# Altium project Metlino.PrjPcb (part 13 of 13)

## Sheet FMC_Metlino_Fabric-Timing.SchDoc
size A4
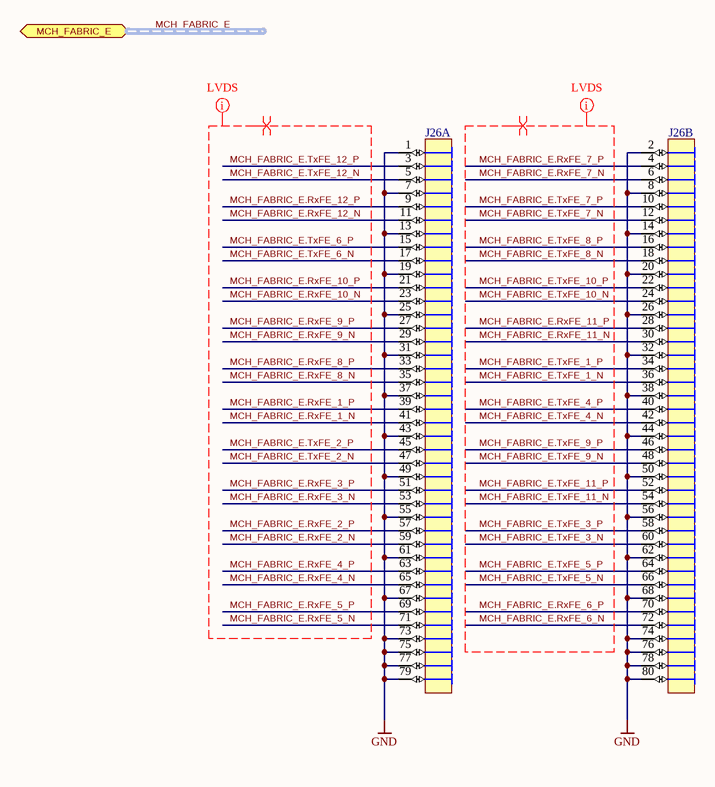
[diagram p29: FMC_Metlino_Fabric-Timing.SchDoc]

### Parts
J26  (no value)  [SAMTEC_FSI-140-XX-X-D-AD_bot]  (parts A,B of 2)  (no BOM)

### Ports
MCH_FABRIC_E (bidir, harness MCH_FABRIC_E)

### Nets
GND: J26.1 J26.2 J26.7 J26.8 J26.13 J26.14 J26.19 J26.20 J26.25 J26.26 J26.31 J26.32 J26.37 J26.38 J26.43 J26.44 J26.49 J26.50 J26.55 J26.56 J26.61 J26.62 J26.67 J26.68 J26.73 J26.74 J26.75 J26.76 J26.77 J26.78 J26.79 J26.80
MCH_FABRIC_E.RxFE_1_N: J26.41
MCH_FABRIC_E.RxFE_1_P: J26.39
MCH_FABRIC_E.RxFE_2_N: J26.59
MCH_FABRIC_E.RxFE_2_P: J26.57
MCH_FABRIC_E.RxFE_3_N: J26.53
MCH_FABRIC_E.RxFE_3_P: J26.51
MCH_FABRIC_E.RxFE_4_N: J26.65
MCH_FABRIC_E.RxFE_4_P: J26.63
MCH_FABRIC_E.RxFE_5_N: J26.71
MCH_FABRIC_E.RxFE_5_P: J26.69
MCH_FABRIC_E.RxFE_6_N: J26.72
MCH_FABRIC_E.RxFE_6_P: J26.70
MCH_FABRIC_E.RxFE_7_N: J26.6
MCH_FABRIC_E.RxFE_7_P: J26.4
MCH_FABRIC_E.RxFE_8_N: J26.35
MCH_FABRIC_E.RxFE_8_P: J26.33
MCH_FABRIC_E.RxFE_9_N: J26.29
MCH_FABRIC_E.RxFE_9_P: J26.27
MCH_FABRIC_E.RxFE_10_N: J26.23
MCH_FABRIC_E.RxFE_10_P: J26.21
MCH_FABRIC_E.RxFE_11_N: J26.30
MCH_FABRIC_E.RxFE_11_P: J26.28
MCH_FABRIC_E.RxFE_12_N: J26.11
MCH_FABRIC_E.RxFE_12_P: J26.9
MCH_FABRIC_E.TxFE_1_N: J26.36
MCH_FABRIC_E.TxFE_1_P: J26.34
MCH_FABRIC_E.TxFE_2_N: J26.47
MCH_FABRIC_E.TxFE_2_P: J26.45
MCH_FABRIC_E.TxFE_3_N: J26.60
MCH_FABRIC_E.TxFE_3_P: J26.58
MCH_FABRIC_E.TxFE_4_N: J26.42
MCH_FABRIC_E.TxFE_4_P: J26.40
MCH_FABRIC_E.TxFE_5_N: J26.66
MCH_FABRIC_E.TxFE_5_P: J26.64
MCH_FABRIC_E.TxFE_6_N: J26.17
MCH_FABRIC_E.TxFE_6_P: J26.15
MCH_FABRIC_E.TxFE_7_N: J26.12
MCH_FABRIC_E.TxFE_7_P: J26.10
MCH_FABRIC_E.TxFE_8_N: J26.18
MCH_FABRIC_E.TxFE_8_P: J26.16
MCH_FABRIC_E.TxFE_9_N: J26.48
MCH_FABRIC_E.TxFE_9_P: J26.46
MCH_FABRIC_E.TxFE_10_N: J26.24
MCH_FABRIC_E.TxFE_10_P: J26.22
MCH_FABRIC_E.TxFE_11_N: J26.54
MCH_FABRIC_E.TxFE_11_P: J26.52
MCH_FABRIC_E.TxFE_12_N: J26.5
MCH_FABRIC_E.TxFE_12_P: J26.3

### Buses and harness runs
harness MCH_FABRIC_E = port MCH_FABRIC_E

### Layout directives
differential pair: MCH_FABRIC_E.RxFE_1_N, MCH_FABRIC_E.RxFE_1_P, MCH_FABRIC_E.RxFE_2_N, MCH_FABRIC_E.RxFE_2_P, MCH_FABRIC_E.RxFE_3_N, MCH_FABRIC_E.RxFE_3_P, MCH_FABRIC_E.RxFE_4_N, MCH_FABRIC_E.RxFE_4_P, MCH_FABRIC_E.RxFE_5_N, MCH_FABRIC_E.RxFE_5_P, MCH_FABRIC_E.RxFE_6_N, MCH_FABRIC_E.RxFE_6_P, MCH_FABRIC_E.RxFE_7_N, MCH_FABRIC_E.RxFE_7_P, MCH_FABRIC_E.RxFE_8_N, MCH_FABRIC_E.RxFE_8_P, MCH_FABRIC_E.RxFE_9_N, MCH_FABRIC_E.RxFE_9_P, MCH_FABRIC_E.RxFE_10_N, MCH_FABRIC_E.RxFE_10_P, MCH_FABRIC_E.RxFE_11_N, MCH_FABRIC_E.RxFE_11_P, MCH_FABRIC_E.RxFE_12_N, MCH_FABRIC_E.RxFE_12_P, MCH_FABRIC_E.TxFE_1_N, MCH_FABRIC_E.TxFE_1_P, MCH_FABRIC_E.TxFE_2_N, MCH_FABRIC_E.TxFE_2_P, MCH_FABRIC_E.TxFE_3_N, MCH_FABRIC_E.TxFE_3_P, MCH_FABRIC_E.TxFE_4_N, MCH_FABRIC_E.TxFE_4_P, MCH_FABRIC_E.TxFE_5_N, MCH_FABRIC_E.TxFE_5_P, MCH_FABRIC_E.TxFE_6_N, MCH_FABRIC_E.TxFE_6_P, MCH_FABRIC_E.TxFE_7_N, MCH_FABRIC_E.TxFE_7_P, MCH_FABRIC_E.TxFE_8_N, MCH_FABRIC_E.TxFE_8_P, MCH_FABRIC_E.TxFE_9_N, MCH_FABRIC_E.TxFE_9_P, MCH_FABRIC_E.TxFE_10_N, MCH_FABRIC_E.TxFE_10_P, MCH_FABRIC_E.TxFE_11_N, MCH_FABRIC_E.TxFE_11_P, MCH_FABRIC_E.TxFE_12_N, MCH_FABRIC_E.TxFE_12_P
net class LVDS: MCH_FABRIC_E.RxFE_1_N, MCH_FABRIC_E.RxFE_1_P, MCH_FABRIC_E.RxFE_2_N, MCH_FABRIC_E.RxFE_2_P, MCH_FABRIC_E.RxFE_3_N, MCH_FABRIC_E.RxFE_3_P, MCH_FABRIC_E.RxFE_4_N, MCH_FABRIC_E.RxFE_4_P, MCH_FABRIC_E.RxFE_5_N, MCH_FABRIC_E.RxFE_5_P, MCH_FABRIC_E.RxFE_6_N, MCH_FABRIC_E.RxFE_6_P, MCH_FABRIC_E.RxFE_7_N, MCH_FABRIC_E.RxFE_7_P, MCH_FABRIC_E.RxFE_8_N, MCH_FABRIC_E.RxFE_8_P, MCH_FABRIC_E.RxFE_9_N, MCH_FABRIC_E.RxFE_9_P, MCH_FABRIC_E.RxFE_10_N, MCH_FABRIC_E.RxFE_10_P, MCH_FABRIC_E.RxFE_11_N, MCH_FABRIC_E.RxFE_11_P, MCH_FABRIC_E.RxFE_12_N, MCH_FABRIC_E.RxFE_12_P, MCH_FABRIC_E.TxFE_1_N, MCH_FABRIC_E.TxFE_1_P, MCH_FABRIC_E.TxFE_2_N, MCH_FABRIC_E.TxFE_2_P, MCH_FABRIC_E.TxFE_3_N, MCH_FABRIC_E.TxFE_3_P, MCH_FABRIC_E.TxFE_4_N, MCH_FABRIC_E.TxFE_4_P, MCH_FABRIC_E.TxFE_5_N, MCH_FABRIC_E.TxFE_5_P, MCH_FABRIC_E.TxFE_6_N, MCH_FABRIC_E.TxFE_6_P, MCH_FABRIC_E.TxFE_7_N, MCH_FABRIC_E.TxFE_7_P, MCH_FABRIC_E.TxFE_8_N, MCH_FABRIC_E.TxFE_8_P, MCH_FABRIC_E.TxFE_9_N, MCH_FABRIC_E.TxFE_9_P, MCH_FABRIC_E.TxFE_10_N, MCH_FABRIC_E.TxFE_10_P, MCH_FABRIC_E.TxFE_11_N, MCH_FABRIC_E.TxFE_11_P, MCH_FABRIC_E.TxFE_12_N, MCH_FABRIC_E.TxFE_12_P

### Library data of the parts
J26 = SAMTEC_FSI-140-10-L-D-AD_bot: Copper Contact Surfaces for Receive 80 Spring Contacts Board to Board & Mezzanine Connectors One-Piece With Alignment Pins; PressFit: No; Part Number: SAMTEC_FSI-140-10-L-D-AD_bot; Component Type: Standard (No BOM); Pin Count: 0; Mounted: Yes; Socket: No; SMD: No; Sense: No; Status: None; Part Description: Copper Contact Surfaces for Receive 80 Spring Contacts Board to Board & Mezzanine Connectors One-Piece With Alignment Pins; ComponentHeight: 0mm; HelpURL: \\cern.ch\dfs\Applications\Altium\Datasheets\SAMTEC_FSI-140-10-L-D-AD.pdf; Author: CERN DEM BC; CreateDate: 08.06.2021; LatestRevisionDate: 08.06.2021

## Nets that join several sheets
GND: Metlino_MCH (25 pins), USB_SERIAL_QUAD (50 pins), SFP1 (37 pins), SFP0 (37 pins), SI5324_CDR_DCXO_oscillators (67 pins), DDMTD (9 pins), FMC_connector (175 pins), SDRAM_DDR3_4x16 (177 pins), JTAG_Configuration (13 pins), POWER_Management (29 pins), PWR_0V9_20A (23 pins), PWR_DC_DC_EXAR (48 pins), Metlino_QUAD_BUCK (40 pins), MCH_CON (116 pins), Metlino_CLK_Distribution (21 pins), Thermometers (24 pins), VHDCI_CON (45 pins), ETH_PHY_RGMII (36 pins), I2C_MUX (7 pins), SFP2 (37 pins), CPU_LPC1776 (12 pins), CPU_LPC1776_SUP_PROG (40 pins), MCH_FPGA_Banks_44_45_46_DDR64 (7 pins), MCH_FPGA_Banks_64_65_HR (C212.1 J25.12 OSC1.2), MCH_FPGA_Banks_224_225_226_227_228 (8 pins), MCH_FPGA_Bank_47_48_67_HP_VHDCI (R253.1), MCH_FPGA_Bank_0_CFG (28 pins), MCH_FPGA_Banks_66_68_HP_FMC (9 pins), MCH_FPGA_Power (18 pins), MCH_FPGA_GND_NC (271 pins), MCH_FPGA_Decoupling (134 pins), FMC_Metlino_Fabric-Timing (32 pins)
MGTAVCC: PWR_DC_DC_EXAR (L15.2 L30.2), MCH_FPGA_Power (14 pins), MCH_FPGA_Decoupling (27 pins)
MGTAVTT: PWR_DC_DC_EXAR (L3.2 R246.1), MCH_FPGA_Bank_0_CFG (IC33.AP6 R405.2), MCH_FPGA_Power (16 pins), MCH_FPGA_Decoupling (22 pins)
MGTVCCAUX: PWR_DC_DC_EXAR (L25.1), MCH_FPGA_Power (IC33.AA6 IC33.R6), MCH_FPGA_Decoupling (5 pins)
P1V5: SDRAM_DDR3_4x16 (131 pins), PWR_DC_DC_EXAR (5 pins), MCH_FPGA_Banks_44_45_46_DDR64 (R193.1 R194.1 R195.1 R196.1), MCH_FPGA_Power (20 pins), MCH_FPGA_Decoupling (9 pins)
P1V8: FMC_connector (7 pins), PWR_DC_DC_EXAR (7 pins), VHDCI_CON (38 pins), MCH_FPGA_Bank_0_CFG (R575.1), MCH_FPGA_Banks_66_68_HP_FMC (R219.1), MCH_FPGA_Power (34 pins), MCH_FPGA_Decoupling (20 pins)
P3V3: USB_SERIAL_QUAD (6 pins), SFP1 (16 pins), SFP0 (16 pins), SI5324_CDR_DCXO_oscillators (R260.1), FMC_connector (6 pins), SDRAM_DDR3_4x16 (C345.1 IC12.7 IC12.10), JTAG_Configuration (6 pins), POWER_Management (R395.1), PWR_DC_DC_EXAR (L12.2 L18.2 R240.2 TP20.1), VHDCI_CON (D53.5 F2.2 F3.2), ETH_PHY_RGMII (9 pins), I2C_MUX (17 pins), SFP2 (16 pins), MCH_FPGA_Banks_64_65_HR (C212.2 J25.11 OSC1.1 OSC1.4), MCH_FPGA_Banks_224_225_226_227_228 (L19.1), MCH_FPGA_Bank_0_CFG (22 pins), MCH_FPGA_Power (15 pins), MCH_FPGA_Decoupling (7 pins)
P3V3_CLK: SI5324_CDR_DCXO_oscillators (7 pins), DDMTD (L29.1), Metlino_CLK_Distribution (L17.1)
P3V3MP: Metlino_MCH (J4.14), USB_SERIAL_QUAD (IC29.1 R398.1 R399.2), POWER_Management (9 pins), PWR_0V9_20A (R387.2), PWR_DC_DC_EXAR (6 pins), Metlino_QUAD_BUCK (R421.2), Thermometers (21 pins), I2C_MUX (9 pins), CPU_LPC1776 (22 pins), CPU_LPC1776_SUP_PROG (39 pins), MCH_FPGA_Bank_0_CFG (C176.2 IC27.14)
P5V0: SI5324_CDR_DCXO_oscillators (L4.1), PWR_DC_DC_EXAR (8 pins), Metlino_QUAD_BUCK (R420.2)
P12V0: POWER_Management (16 pins), PWR_0V9_20A (14 pins), PWR_DC_DC_EXAR (9 pins), Metlino_QUAD_BUCK (10 pins)
PAYLOAD_PWR: Metlino_MCH (J4.9 J4.10 J4.11 J4.12), POWER_Management (C181.2 T5.1 T5.2 T5.3)
Vbias_0.9V: MCH_FPGA_Bank_47_48_67_HP_VHDCI (R47.1 R48.1 R49.1 R86.1), MCH_FPGA_Banks_66_68_HP_FMC (16 pins)
VCCAUX: PWR_DC_DC_EXAR (L24.2 L36.2), MCH_FPGA_Power (15 pins), MCH_FPGA_Decoupling (8 pins)
VCCBRAM: PWR_DC_DC_EXAR (L8.2 R141.2), MCH_FPGA_Power (IC33.AA18 IC33.AB17 IC33.V17 IC33.Y17), MCH_FPGA_Decoupling (10 pins)
VCCINT: PWR_0V9_20A (R393.1 R415.2 R416.2), PWR_DC_DC_EXAR (R141.1 R243.1 TP22.1), MCH_FPGA_Power (49 pins), MCH_FPGA_Decoupling (26 pins)
VTT64: SDRAM_DDR3_4x16 (43 pins), MCH_FPGA_Banks_44_45_46_DDR64 (R11.1 R210.1)
AUX_CLOCK_C2_N: SI5324_CDR_DCXO_oscillators (C108.2 R93.1), Metlino_CLK_Distribution (IC42.21 R347.1)
AUX_CLOCK_C2_P: SI5324_CDR_DCXO_oscillators (C107.2 R93.2), Metlino_CLK_Distribution (IC42.22 R348.1)
AUX_UART_RxD: USB_SERIAL_QUAD (R122.1), MCH_FPGA_Banks_64_65_HR (IC33.AF13)
AUX_UART_TxD: USB_SERIAL_QUAD (R123.1), MCH_FPGA_Banks_64_65_HR (IC33.AE13)
BOOT_MODE0: CPU_LPC1776 (IC40.P9), MCH_FPGA_Bank_0_CFG (R183.2)
BOOT_MODE1: CPU_LPC1776 (IC40.P11), MCH_FPGA_Bank_0_CFG (R182.2)
BOOT_MODE2: CPU_LPC1776 (IC40.P3), MCH_FPGA_Bank_0_CFG (R181.2)
BOOT_MODE3: CPU_LPC1776 (IC40.N5), MCH_FPGA_Bank_0_CFG (R186.2)
CDR_CLK_CLEAN0_N: SI5324_CDR_DCXO_oscillators (C550.2), MCH_FPGA_Banks_66_68_HP_FMC (IC33.G16 R255.2)
CDR_CLK_CLEAN0_P: SI5324_CDR_DCXO_oscillators (C549.2), MCH_FPGA_Banks_66_68_HP_FMC (IC33.G17 R254.2)
CDR_CLK_CLEAN1_N: SI5324_CDR_DCXO_oscillators (C554.2), MCH_FPGA_Banks_224_225_226_227_228 (IC33.V5)
CDR_CLK_CLEAN1_P: SI5324_CDR_DCXO_oscillators (C553.2), MCH_FPGA_Banks_224_225_226_227_228 (IC33.V6)
CDR_CLK_CLEAN2_N: SI5324_CDR_DCXO_oscillators (C544.2), MCH_FPGA_Banks_224_225_226_227_228 (IC33.AB5)
CDR_CLK_CLEAN2_P: SI5324_CDR_DCXO_oscillators (C543.2), MCH_FPGA_Banks_224_225_226_227_228 (IC33.AB6)
CLK0_M2C_N: FMC_connector (J7.h5), MCH_FPGA_Banks_66_68_HP_FMC (IC33.F9)
CLK0_M2C_P: FMC_connector (J7.h4), MCH_FPGA_Banks_66_68_HP_FMC (IC33.G9)
CLK1_M2C_N: FMC_connector (J7.g3), MCH_FPGA_Banks_66_68_HP_FMC (IC33.G12)
CLK1_M2C_P: FMC_connector (J7.g2), MCH_FPGA_Banks_66_68_HP_FMC (IC33.H12)
CLK2_BIDIR_N: SI5324_CDR_DCXO_oscillators (C559.2), FMC_connector (J7.k5)
CLK2_BIDIR_P: SI5324_CDR_DCXO_oscillators (C558.2), FMC_connector (J7.k4)
CLK3_BIDIR_N: FMC_connector (J7.j3), Metlino_CLK_Distribution (C321.2)
CLK3_BIDIR_P: FMC_connector (J7.j2), Metlino_CLK_Distribution (C322.2)
CLK_DIR: FMC_connector (J7.b1), CPU_LPC1776 (R325.1 R326.1)
CLK_MUX_SEL: Metlino_CLK_Distribution (IC42.32), MCH_FPGA_Banks_64_65_HR (IC33.AK11)
DDMTD_OUT_CDR_CLK_N: DDMTD (R438.1 R439.2), MCH_FPGA_Banks_66_68_HP_FMC (C226.2)
DDMTD_OUT_CDR_CLK_P: DDMTD (R435.2 R436.2), MCH_FPGA_Banks_66_68_HP_FMC (C225.2)
DDMTD_OUT_MAIN_CLK_N: DDMTD (R449.1 R451.2), MCH_FPGA_Banks_66_68_HP_FMC (C224.2)
DDMTD_OUT_MAIN_CLK_P: DDMTD (R443.2 R445.2), MCH_FPGA_Banks_66_68_HP_FMC (C223.2)
DDR3_64_A0: SDRAM_DDR3_4x16 (5 pins), MCH_FPGA_Banks_44_45_46_DDR64 (IC33.AE17)
DDR3_64_A1: SDRAM_DDR3_4x16 (5 pins), MCH_FPGA_Banks_44_45_46_DDR64 (IC33.AL17)
DDR3_64_A2: SDRAM_DDR3_4x16 (5 pins), MCH_FPGA_Banks_44_45_46_DDR64 (IC33.AG16)
DDR3_64_A3: SDRAM_DDR3_4x16 (5 pins), MCH_FPGA_Banks_44_45_46_DDR64 (IC33.AG17)
DDR3_64_A4: SDRAM_DDR3_4x16 (5 pins), MCH_FPGA_Banks_44_45_46_DDR64 (IC33.AD16)
DDR3_64_A5: SDRAM_DDR3_4x16 (5 pins), MCH_FPGA_Banks_44_45_46_DDR64 (IC33.AH14)
DDR3_64_A6: SDRAM_DDR3_4x16 (5 pins), MCH_FPGA_Banks_44_45_46_DDR64 (IC33.AD15)
DDR3_64_A7: SDRAM_DDR3_4x16 (5 pins), MCH_FPGA_Banks_44_45_46_DDR64 (IC33.AK15)
DDR3_64_A8: SDRAM_DDR3_4x16 (5 pins), MCH_FPGA_Banks_44_45_46_DDR64 (IC33.AF14)
DDR3_64_A9: SDRAM_DDR3_4x16 (5 pins), MCH_FPGA_Banks_44_45_46_DDR64 (IC33.AF15)
DDR3_64_A10: SDRAM_DDR3_4x16 (5 pins), MCH_FPGA_Banks_44_45_46_DDR64 (IC33.AL18)
DDR3_64_A11: SDRAM_DDR3_4x16 (5 pins), MCH_FPGA_Banks_44_45_46_DDR64 (IC33.AL15)
DDR3_64_A12: SDRAM_DDR3_4x16 (5 pins), MCH_FPGA_Banks_44_45_46_DDR64 (IC33.AE18)
DDR3_64_A13: SDRAM_DDR3_4x16 (5 pins), MCH_FPGA_Banks_44_45_46_DDR64 (IC33.AJ15)
DDR3_64_A14: SDRAM_DDR3_4x16 (5 pins), MCH_FPGA_Banks_44_45_46_DDR64 (IC33.AG14)
DDR3_64_BA0: SDRAM_DDR3_4x16 (5 pins), MCH_FPGA_Banks_44_45_46_DDR64 (IC33.AF17)
DDR3_64_BA1: SDRAM_DDR3_4x16 (5 pins), MCH_FPGA_Banks_44_45_46_DDR64 (IC33.AD19)
DDR3_64_BA2: SDRAM_DDR3_4x16 (5 pins), MCH_FPGA_Banks_44_45_46_DDR64 (IC33.AD18)
DDR3_64_CAS_N: SDRAM_DDR3_4x16 (5 pins), MCH_FPGA_Banks_44_45_46_DDR64 (IC33.AK18)
DDR3_64_CK_N: SDRAM_DDR3_4x16 (5 pins), MCH_FPGA_Banks_44_45_46_DDR64 (IC33.AE15)
DDR3_64_CK_P: SDRAM_DDR3_4x16 (5 pins), MCH_FPGA_Banks_44_45_46_DDR64 (IC33.AE16)
DDR3_64_CKE: SDRAM_DDR3_4x16 (5 pins), MCH_FPGA_Banks_44_45_46_DDR64 (IC33.AL19)
DDR3_64_CS_N: SDRAM_DDR3_4x16 (5 pins), MCH_FPGA_Banks_44_45_46_DDR64 (IC33.AF18)
DDR3_64_DM0: SDRAM_DDR3_4x16 (IC8.E7), MCH_FPGA_Banks_44_45_46_DDR64 (IC33.AD21)
DDR3_64_DM1: SDRAM_DDR3_4x16 (IC8.D3), MCH_FPGA_Banks_44_45_46_DDR64 (IC33.AE25)
DDR3_64_DM2: SDRAM_DDR3_4x16 (IC9.E7), MCH_FPGA_Banks_44_45_46_DDR64 (IC33.AJ21)
DDR3_64_DM3: SDRAM_DDR3_4x16 (IC9.D3), MCH_FPGA_Banks_44_45_46_DDR64 (IC33.AM21)
DDR3_64_DM4: SDRAM_DDR3_4x16 (IC10.E7), MCH_FPGA_Banks_44_45_46_DDR64 (IC33.AH26)
DDR3_64_DM5: SDRAM_DDR3_4x16 (IC10.D3), MCH_FPGA_Banks_44_45_46_DDR64 (IC33.AN26)
DDR3_64_DM6: SDRAM_DDR3_4x16 (IC11.E7), MCH_FPGA_Banks_44_45_46_DDR64 (IC33.AJ29)
DDR3_64_DM7: SDRAM_DDR3_4x16 (IC11.D3), MCH_FPGA_Banks_44_45_46_DDR64 (IC33.AL32)
DDR3_64_DQ0: SDRAM_DDR3_4x16 (IC8.E3), MCH_FPGA_Banks_44_45_46_DDR64 (IC33.AE23)
DDR3_64_DQ1: SDRAM_DDR3_4x16 (IC8.F7), MCH_FPGA_Banks_44_45_46_DDR64 (IC33.AG20)
DDR3_64_DQ2: SDRAM_DDR3_4x16 (IC8.F2), MCH_FPGA_Banks_44_45_46_DDR64 (IC33.AF22)
DDR3_64_DQ3: SDRAM_DDR3_4x16 (IC8.F8), MCH_FPGA_Banks_44_45_46_DDR64 (IC33.AF20)
DDR3_64_DQ4: SDRAM_DDR3_4x16 (IC8.H3), MCH_FPGA_Banks_44_45_46_DDR64 (IC33.AE22)
DDR3_64_DQ5: SDRAM_DDR3_4x16 (IC8.H8), MCH_FPGA_Banks_44_45_46_DDR64 (IC33.AD20)
DDR3_64_DQ6: SDRAM_DDR3_4x16 (IC8.G2), MCH_FPGA_Banks_44_45_46_DDR64 (IC33.AG22)
DDR3_64_DQ7: SDRAM_DDR3_4x16 (IC8.H7), MCH_FPGA_Banks_44_45_46_DDR64 (IC33.AE20)
DDR3_64_DQ8: SDRAM_DDR3_4x16 (IC8.D7), MCH_FPGA_Banks_44_45_46_DDR64 (IC33.AJ24)
DDR3_64_DQ9: SDRAM_DDR3_4x16 (IC8.C3), MCH_FPGA_Banks_44_45_46_DDR64 (IC33.AG24)
DDR3_64_DQ10: SDRAM_DDR3_4x16 (IC8.C8), MCH_FPGA_Banks_44_45_46_DDR64 (IC33.AJ23)
DDR3_64_DQ11: SDRAM_DDR3_4x16 (IC8.C2), MCH_FPGA_Banks_44_45_46_DDR64 (IC33.AF23)
DDR3_64_DQ12: SDRAM_DDR3_4x16 (IC8.A7), MCH_FPGA_Banks_44_45_46_DDR64 (IC33.AH23)
DDR3_64_DQ13: SDRAM_DDR3_4x16 (IC8.A2), MCH_FPGA_Banks_44_45_46_DDR64 (IC33.AF24)
DDR3_64_DQ14: SDRAM_DDR3_4x16 (IC8.B8), MCH_FPGA_Banks_44_45_46_DDR64 (IC33.AH22)
DDR3_64_DQ15: SDRAM_DDR3_4x16 (IC8.A3), MCH_FPGA_Banks_44_45_46_DDR64 (IC33.AG25)
DDR3_64_DQ16: SDRAM_DDR3_4x16 (IC9.E3), MCH_FPGA_Banks_44_45_46_DDR64 (IC33.AL22)
DDR3_64_DQ17: SDRAM_DDR3_4x16 (IC9.F7), MCH_FPGA_Banks_44_45_46_DDR64 (IC33.AL25)
DDR3_64_DQ18: SDRAM_DDR3_4x16 (IC9.F2), MCH_FPGA_Banks_44_45_46_DDR64 (IC33.AM20)
DDR3_64_DQ19: SDRAM_DDR3_4x16 (IC9.F8), MCH_FPGA_Banks_44_45_46_DDR64 (IC33.AK23)
DDR3_64_DQ20: SDRAM_DDR3_4x16 (IC9.H3), MCH_FPGA_Banks_44_45_46_DDR64 (IC33.AK22)
DDR3_64_DQ21: SDRAM_DDR3_4x16 (IC9.H8), MCH_FPGA_Banks_44_45_46_DDR64 (IC33.AL24)
DDR3_64_DQ22: SDRAM_DDR3_4x16 (IC9.G2), MCH_FPGA_Banks_44_45_46_DDR64 (IC33.AL20)
DDR3_64_DQ23: SDRAM_DDR3_4x16 (IC9.H7), MCH_FPGA_Banks_44_45_46_DDR64 (IC33.AL23)
DDR3_64_DQ24: SDRAM_DDR3_4x16 (IC9.D7), MCH_FPGA_Banks_44_45_46_DDR64 (IC33.AM24)
DDR3_64_DQ25: SDRAM_DDR3_4x16 (IC9.C3), MCH_FPGA_Banks_44_45_46_DDR64 (IC33.AN23)
DDR3_64_DQ26: SDRAM_DDR3_4x16 (IC9.C8), MCH_FPGA_Banks_44_45_46_DDR64 (IC33.AN24)
DDR3_64_DQ27: SDRAM_DDR3_4x16 (IC9.C2), MCH_FPGA_Banks_44_45_46_DDR64 (IC33.AP23)
DDR3_64_DQ28: SDRAM_DDR3_4x16 (IC9.A7), MCH_FPGA_Banks_44_45_46_DDR64 (IC33.AP25)
DDR3_64_DQ29: SDRAM_DDR3_4x16 (IC9.A2), MCH_FPGA_Banks_44_45_46_DDR64 (IC33.AN22)
DDR3_64_DQ30: SDRAM_DDR3_4x16 (IC9.B8), MCH_FPGA_Banks_44_45_46_DDR64 (IC33.AP24)
DDR3_64_DQ31: SDRAM_DDR3_4x16 (IC9.A3), MCH_FPGA_Banks_44_45_46_DDR64 (IC33.AM22)
DDR3_64_DQ32: SDRAM_DDR3_4x16 (IC10.E3), MCH_FPGA_Banks_44_45_46_DDR64 (IC33.AH28)
DDR3_64_DQ33: SDRAM_DDR3_4x16 (IC10.F7), MCH_FPGA_Banks_44_45_46_DDR64 (IC33.AK26)
DDR3_64_DQ34: SDRAM_DDR3_4x16 (IC10.F2), MCH_FPGA_Banks_44_45_46_DDR64 (IC33.AK28)
DDR3_64_DQ35: SDRAM_DDR3_4x16 (IC10.F8), MCH_FPGA_Banks_44_45_46_DDR64 (IC33.AM27)
DDR3_64_DQ36: SDRAM_DDR3_4x16 (IC10.H3), MCH_FPGA_Banks_44_45_46_DDR64 (IC33.AJ28)
DDR3_64_DQ37: SDRAM_DDR3_4x16 (IC10.H8), MCH_FPGA_Banks_44_45_46_DDR64 (IC33.AH27)
DDR3_64_DQ38: SDRAM_DDR3_4x16 (IC10.G2), MCH_FPGA_Banks_44_45_46_DDR64 (IC33.AK27)
DDR3_64_DQ39: SDRAM_DDR3_4x16 (IC10.H7), MCH_FPGA_Banks_44_45_46_DDR64 (IC33.AM26)
DDR3_64_DQ40: SDRAM_DDR3_4x16 (IC10.D7), MCH_FPGA_Banks_44_45_46_DDR64 (IC33.AL30)
DDR3_64_DQ41: SDRAM_DDR3_4x16 (IC10.C3), MCH_FPGA_Banks_44_45_46_DDR64 (IC33.AP29)
DDR3_64_DQ42: SDRAM_DDR3_4x16 (IC10.C8), MCH_FPGA_Banks_44_45_46_DDR64 (IC33.AM30)
DDR3_64_DQ43: SDRAM_DDR3_4x16 (IC10.C2), MCH_FPGA_Banks_44_45_46_DDR64 (IC33.AN28)
DDR3_64_DQ44: SDRAM_DDR3_4x16 (IC10.A7), MCH_FPGA_Banks_44_45_46_DDR64 (IC33.AL29)
DDR3_64_DQ45: SDRAM_DDR3_4x16 (IC10.A2), MCH_FPGA_Banks_44_45_46_DDR64 (IC33.AP28)
DDR3_64_DQ46: SDRAM_DDR3_4x16 (IC10.B8), MCH_FPGA_Banks_44_45_46_DDR64 (IC33.AM29)
DDR3_64_DQ47: SDRAM_DDR3_4x16 (IC10.A3), MCH_FPGA_Banks_44_45_46_DDR64 (IC33.AN27)
DDR3_64_DQ48: SDRAM_DDR3_4x16 (IC11.E3), MCH_FPGA_Banks_44_45_46_DDR64 (IC33.AH31)
DDR3_64_DQ49: SDRAM_DDR3_4x16 (IC11.F7), MCH_FPGA_Banks_44_45_46_DDR64 (IC33.AH32)
DDR3_64_DQ50: SDRAM_DDR3_4x16 (IC11.F2), MCH_FPGA_Banks_44_45_46_DDR64 (IC33.AJ34)
DDR3_64_DQ51: SDRAM_DDR3_4x16 (IC11.F8), MCH_FPGA_Banks_44_45_46_DDR64 (IC33.AK31)
DDR3_64_DQ52: SDRAM_DDR3_4x16 (IC11.H3), MCH_FPGA_Banks_44_45_46_DDR64 (IC33.AJ31)
DDR3_64_DQ53: SDRAM_DDR3_4x16 (IC11.H8), MCH_FPGA_Banks_44_45_46_DDR64 (IC33.AJ30)
DDR3_64_DQ54: SDRAM_DDR3_4x16 (IC11.G2), MCH_FPGA_Banks_44_45_46_DDR64 (IC33.AH34)
DDR3_64_DQ55: SDRAM_DDR3_4x16 (IC11.H7), MCH_FPGA_Banks_44_45_46_DDR64 (IC33.AK32)
DDR3_64_DQ56: SDRAM_DDR3_4x16 (IC11.D7), MCH_FPGA_Banks_44_45_46_DDR64 (IC33.AN33)
DDR3_64_DQ57: SDRAM_DDR3_4x16 (IC11.C3), MCH_FPGA_Banks_44_45_46_DDR64 (IC33.AP33)
DDR3_64_DQ58: SDRAM_DDR3_4x16 (IC11.C8), MCH_FPGA_Banks_44_45_46_DDR64 (IC33.AM34)
DDR3_64_DQ59: SDRAM_DDR3_4x16 (IC11.C2), MCH_FPGA_Banks_44_45_46_DDR64 (IC33.AP31)
DDR3_64_DQ60: SDRAM_DDR3_4x16 (IC11.A7), MCH_FPGA_Banks_44_45_46_DDR64 (IC33.AM32)
DDR3_64_DQ61: SDRAM_DDR3_4x16 (IC11.A2), MCH_FPGA_Banks_44_45_46_DDR64 (IC33.AN31)
DDR3_64_DQ62: SDRAM_DDR3_4x16 (IC11.B8), MCH_FPGA_Banks_44_45_46_DDR64 (IC33.AL34)
DDR3_64_DQ63: SDRAM_DDR3_4x16 (IC11.A3), MCH_FPGA_Banks_44_45_46_DDR64 (IC33.AN32)
DDR3_64_DQS0_N: SDRAM_DDR3_4x16 (IC8.G3), MCH_FPGA_Banks_44_45_46_DDR64 (IC33.AH21)
DDR3_64_DQS0_P: SDRAM_DDR3_4x16 (IC8.F3), MCH_FPGA_Banks_44_45_46_DDR64 (IC33.AG21)
DDR3_64_DQS1_N: SDRAM_DDR3_4x16 (IC8.B7), MCH_FPGA_Banks_44_45_46_DDR64 (IC33.AJ25)
DDR3_64_DQS1_P: SDRAM_DDR3_4x16 (IC8.C7), MCH_FPGA_Banks_44_45_46_DDR64 (IC33.AH24)
DDR3_64_DQS2_N: SDRAM_DDR3_4x16 (IC9.G3), MCH_FPGA_Banks_44_45_46_DDR64 (IC33.AK20)
DDR3_64_DQS2_P: SDRAM_DDR3_4x16 (IC9.F3), MCH_FPGA_Banks_44_45_46_DDR64 (IC33.AJ20)
DDR3_64_DQS3_N: SDRAM_DDR3_4x16 (IC9.B7), MCH_FPGA_Banks_44_45_46_DDR64 (IC33.AP21)
DDR3_64_DQS3_P: SDRAM_DDR3_4x16 (IC9.C7), MCH_FPGA_Banks_44_45_46_DDR64 (IC33.AP20)
DDR3_64_DQS4_N: SDRAM_DDR3_4x16 (IC10.G3), MCH_FPGA_Banks_44_45_46_DDR64 (IC33.AL28)
DDR3_64_DQS4_P: SDRAM_DDR3_4x16 (IC10.F3), MCH_FPGA_Banks_44_45_46_DDR64 (IC33.AL27)
DDR3_64_DQS5_N: SDRAM_DDR3_4x16 (IC10.B7), MCH_FPGA_Banks_44_45_46_DDR64 (IC33.AP30)
DDR3_64_DQS5_P: SDRAM_DDR3_4x16 (IC10.C7), MCH_FPGA_Banks_44_45_46_DDR64 (IC33.AN29)
DDR3_64_DQS6_N: SDRAM_DDR3_4x16 (IC11.G3), MCH_FPGA_Banks_44_45_46_DDR64 (IC33.AJ33)
DDR3_64_DQS6_P: SDRAM_DDR3_4x16 (IC11.F3), MCH_FPGA_Banks_44_45_46_DDR64 (IC33.AH33)
DDR3_64_DQS7_N: SDRAM_DDR3_4x16 (IC11.B7), MCH_FPGA_Banks_44_45_46_DDR64 (IC33.AP34)
DDR3_64_DQS7_P: SDRAM_DDR3_4x16 (IC11.C7), MCH_FPGA_Banks_44_45_46_DDR64 (IC33.AN34)
DDR3_64_ODT: SDRAM_DDR3_4x16 (5 pins), MCH_FPGA_Banks_44_45_46_DDR64 (IC33.AJ18)
DDR3_64_RAS_N: SDRAM_DDR3_4x16 (5 pins), MCH_FPGA_Banks_44_45_46_DDR64 (IC33.AH19)
DDR3_64_RST_N: SDRAM_DDR3_4x16 (5 pins), MCH_FPGA_Banks_44_45_46_DDR64 (IC33.AJ14)
DDR3_64_VREF: SDRAM_DDR3_4x16 (18 pins), MCH_FPGA_Bank_0_CFG (6 pins)
DDR3_64_WE_N: SDRAM_DDR3_4x16 (5 pins), MCH_FPGA_Banks_44_45_46_DDR64 (IC33.AG19)
EN_1V0: Metlino_QUAD_BUCK (IC23.C6), CPU_LPC1776 (IC40.A14)
EN_1V2: PWR_DC_DC_EXAR (IC4.11 MOD1.2 R146.2), CPU_LPC1776 (IC40.A7)
EN_1V5: Metlino_QUAD_BUCK (IC23.F6), CPU_LPC1776 (IC40.A8)
EN_1V8: Metlino_QUAD_BUCK (IC23.K7), CPU_LPC1776 (IC40.D8)
EN_3V3: Metlino_QUAD_BUCK (IC23.J6), CPU_LPC1776 (IC40.D14)
EN_FLASH_UPDATE: CPU_LPC1776 (IC40.J4), MCH_FPGA_Bank_0_CFG (5 pins)
EN_FMC1_P12V: POWER_Management (R17.2 T4.1), CPU_LPC1776 (IC40.M9)
EN_P0V9: PWR_0V9_20A (IC28.2 R388.2), CPU_LPC1776 (IC40.P10)
EN_P0V95: PWR_DC_DC_EXAR (IC14.11 MOD1.3 R149.2), CPU_LPC1776 (IC40.A12)
EN_P5V0: PWR_DC_DC_EXAR (IC15.6), CPU_LPC1776 (IC40.N10)
EN_PSU_CH: PWR_DC_DC_EXAR (MOD1.6 R151.2), CPU_LPC1776 (IC40.K2)
EXT_CLK_IN_N: SI5324_CDR_DCXO_oscillators (C547.2), MCH_FPGA_Bank_47_48_67_HP_VHDCI (IC33.V23 R48.2)
EXT_CLK_IN_P: SI5324_CDR_DCXO_oscillators (C546.2), MCH_FPGA_Bank_47_48_67_HP_VHDCI (IC33.V22 R47.2)
FLASH_UPD_CLK: CPU_LPC1776 (IC40.K6), MCH_FPGA_Bank_0_CFG (IC27.3)
FLASH_UPD_CSB: CPU_LPC1776 (IC40.N6), MCH_FPGA_Bank_0_CFG (IC27.10)
FLASH_UPD_MISO: CPU_LPC1776 (IC40.N7), MCH_FPGA_Bank_0_CFG (IC27.9)
FLASH_UPD_MOSI: CPU_LPC1776 (IC40.P7), MCH_FPGA_Bank_0_CFG (IC27.2)
FMC1_JTAG.TCK: FMC_connector (J7.d29), JTAG_Configuration (R42.1)
FMC1_JTAG.TDI: FMC_connector (J7.d30), JTAG_Configuration (IC13.1 R43.1)
FMC1_JTAG.TDO: FMC_connector (J7.d31), JTAG_Configuration (IC13.2 R44.1)
FMC1_JTAG.TMS: FMC_connector (J7.d33), JTAG_Configuration (R45.1)
FMC1_JTAG.TRSTn: FMC_connector (J7.d34), JTAG_Configuration (R46.1)
FMC1_MISC.FMC_PG_C2M: FMC_connector (J7.d1), CPU_LPC1776 (R285.1 R292.1)
FMC1_MISC.FMC_PG_M2C: FMC_connector (J7.f1), CPU_LPC1776 (R284.1 R318.1)
FMC1_MISC.FMC_PS#: FMC_connector (J7.h2), JTAG_Configuration (R115.1), CPU_LPC1776 (R283.1 R294.1)
FMC1_VREF_A_M2C: FMC_connector (J7.h1), MCH_FPGA_Bank_0_CFG (C169.1 C175.1 IC33.AA30 IC33.V24)
FMC_SCL: FMC_connector (J7.c30), I2C_MUX (IC43.2 IC44.2 R360.2)
FMC_SDA: FMC_connector (J7.c31), I2C_MUX (IC43.1 IC44.1 R359.2)
FPGA_I2C_SCL: I2C_MUX (IC43.19 R378.1), CPU_LPC1776 (R313.1), MCH_FPGA_Banks_64_65_HR (IC33.N21)
FPGA_I2C_SDA: I2C_MUX (IC43.20 R377.1), CPU_LPC1776 (R314.1), MCH_FPGA_Banks_64_65_HR (IC33.M21)
FPGA_RESETn: CPU_LPC1776 (IC40.H12 R323.2), MCH_FPGA_Banks_64_65_HR (IC33.AJ11)
FPGA_STATUS: CPU_LPC1776 (IC40.M5), MCH_FPGA_Banks_64_65_HR (IC33.K21)
FRONT_PANEL_SMA_CLK_GND: Metlino_MCH (C2.1 J1.2 R98.2), Metlino_CLK_Distribution (R354.1)
FRONT_SMA_CLK_IN: Metlino_MCH (J1.1), Metlino_CLK_Distribution (C329.1)
Helper_CLK_N: SI5324_CDR_DCXO_oscillators (R332.2), DDMTD (C540.1), MCH_FPGA_Banks_66_68_HP_FMC (IC33.E17 R111.2)
Helper_CLK_P: SI5324_CDR_DCXO_oscillators (R331.2), DDMTD (C539.1), MCH_FPGA_Banks_66_68_HP_FMC (IC33.E18 R110.2)
I2C_MUX_ADDR1: I2C_MUX (R366.1 R375.1), CPU_LPC1776 (IC40.L1)
I2C_MUX_ADDR2: I2C_MUX (R365.1 R374.1), CPU_LPC1776 (IC40.M2)
I2C_SW_FPGA_RESETn: I2C_MUX (IC43.24 R114.1), MCH_FPGA_Banks_64_65_HR (IC33.AP8)
I2C_SW_RESETn: I2C_MUX (IC44.24), CPU_LPC1776 (IC40.E5 R312.2)
IPMB_SCL: Metlino_MCH (J4.23), CPU_LPC1776 (D9.1 IC40.M1 R290.2)
IPMB_SDA: Metlino_MCH (J4.25), CPU_LPC1776 (D8.1 IC40.L3 R289.2)
ISP_RSTn: USB_SERIAL_QUAD (T9.3), CPU_LPC1776_SUP_PROG (SW2.1)
LPC_ISP_SWn: CPU_LPC1776 (IC40.M13), CPU_LPC1776_SUP_PROG (SW2.7)
LPC_ISPn: USB_SERIAL_QUAD (IC29.4 R399.1), CPU_LPC1776_SUP_PROG (SW2.2)
LTM_1V5_OUT: PWR_DC_DC_EXAR (C265.2 L26.1 L35.1 MOD1.22), Metlino_QUAD_BUCK (5 pins)
LTM_1V8_OUT: PWR_DC_DC_EXAR (C264.2 L16.1 L34.1 MOD1.18), Metlino_QUAD_BUCK (5 pins)
LTM_1V_OUT: PWR_DC_DC_EXAR (5 pins), Metlino_QUAD_BUCK (5 pins)
LTM_3V3_OUT: PWR_DC_DC_EXAR (C231.2 L12.1 L18.1 MOD1.13), Metlino_QUAD_BUCK (5 pins)
LTM_PGOOD: Metlino_QUAD_BUCK (5 pins), CPU_LPC1776 (IC40.B8)
Main_DCXO_N: SI5324_CDR_DCXO_oscillators (C557.2 C561.2 IC16.2), DDMTD (C538.1)
Main_DCXO_P: SI5324_CDR_DCXO_oscillators (C556.2 IC16.1), DDMTD (C537.1)
MGT_CDR_CLK_N: DDMTD (C536.1 R441.2), MCH_FPGA_Banks_224_225_226_227_228 (IC33.H5)
MGT_CDR_CLK_P: DDMTD (C532.1 R441.1), MCH_FPGA_Banks_224_225_226_227_228 (IC33.H6)
MMC_CONS_PROG_RxD: USB_SERIAL_QUAD (IC29.2), CPU_LPC1776 (IC40.A3)
MMC_CONS_PROG_TxD: USB_SERIAL_QUAD (IC29.3), CPU_LPC1776 (IC40.D5)
MMC_FPGA_DONE: CPU_LPC1776 (IC40.B11), MCH_FPGA_Bank_0_CFG (R173.2)
MMC_FPGA_INIT_B: CPU_LPC1776 (IC40.J5), MCH_FPGA_Bank_0_CFG (R174.2)
MMC_FPGA_PROG_B: CPU_LPC1776 (IC40.A11), MCH_FPGA_Bank_0_CFG (R172.2)
MMC_MISO1: CPU_LPC1776 (IC40.C12), MCH_FPGA_Banks_64_65_HR (IC33.AJ8)
MMC_MOSI1: CPU_LPC1776 (IC40.A13), MCH_FPGA_Banks_64_65_HR (IC33.AJ9)
MMC_SCK1: CPU_LPC1776 (IC40.B12), MCH_FPGA_Banks_64_65_HR (IC33.AK8)
MMC_SCL: I2C_MUX (IC44.19 R380.1), CPU_LPC1776 (IC40.N11)
MMC_SDA: I2C_MUX (IC44.20 R379.1), CPU_LPC1776 (IC40.M10)
MMC_SSEL1: CPU_LPC1776 (IC40.D11), MCH_FPGA_Banks_64_65_HR (IC33.AL8)
MRnR: Metlino_MCH (J4.26), CPU_LPC1776 (R291.1 R301.1), CPU_LPC1776_SUP_PROG (D14.1 R275.2 R321.1 SW2.4)
NetIC13_4: JTAG_Configuration (IC13.4 R115.2), CPU_LPC1776 (IC40.K13)
NetIC17_1: SI5324_CDR_DCXO_oscillators (IC17.1), CPU_LPC1776 (IC40.B6)
NetIC34_3: Thermometers (6 pins), CPU_LPC1776 (IC40.F11)
P0V95_PG: PWR_DC_DC_EXAR (IC14.9 MOD1.8 R143.1), CPU_LPC1776 (IC40.C9)
P0V95I_PG: PWR_0V9_20A (IC28.3 R387.1), PWR_DC_DC_EXAR (R150.2), CPU_LPC1776 (IC40.P5)
P1V2_PG: PWR_DC_DC_EXAR (IC4.9 MOD1.7 R142.1), CPU_LPC1776 (IC40.L5)
P12V0_OK: POWER_Management (IC5.1 R27.1), CPU_LPC1776 (IC40.N4)
PGOOD: SDRAM_DDR3_4x16 (IC12.9), CPU_LPC1776 (IC40.E14)
PGOOD_P5V0: PWR_DC_DC_EXAR (IC15.7 R242.2), CPU_LPC1776 (IC40.M6)
PM_I2C.SCL: POWER_Management (IC45.5), PWR_DC_DC_EXAR (D12.1 MOD1.11 W11.2), Thermometers (6 pins), I2C_MUX (IC43.13 IC44.13 R369.2)
PM_I2C.SDA: POWER_Management (IC45.6), PWR_DC_DC_EXAR (D13.1 MOD1.10 W11.3), Thermometers (6 pins), I2C_MUX (IC43.12 IC44.12 R368.2)
PRI_UART_RxD: USB_SERIAL_QUAD (R120.1), MCH_FPGA_Banks_64_65_HR (IC33.K22)
PRI_UART_TxD: USB_SERIAL_QUAD (R121.1), MCH_FPGA_Banks_64_65_HR (IC33.K20)
QSPI1_CS_B: MCH_FPGA_Banks_64_65_HR (IC33.G26), MCH_FPGA_Bank_0_CFG (IC3.7 R163.1)
QSPI1_IO0: MCH_FPGA_Banks_64_65_HR (IC33.M20), MCH_FPGA_Bank_0_CFG (R199.1)
QSPI1_IO1: MCH_FPGA_Banks_64_65_HR (IC33.L20), MCH_FPGA_Bank_0_CFG (R200.1)
QSPI1_IO2: MCH_FPGA_Banks_64_65_HR (IC33.R21), MCH_FPGA_Bank_0_CFG (R170.1 R201.1)
QSPI1_IO3: MCH_FPGA_Banks_64_65_HR (IC33.R22), MCH_FPGA_Bank_0_CFG (R162.1 R202.1)
REAR_SMA_CLK_GND: Metlino_MCH (C1.1 J3.2 R92.2), Metlino_CLK_Distribution (R353.1)
REAR_SMA_CLK_IN: Metlino_MCH (J3.1), Metlino_CLK_Distribution (C326.1)
REC_CLOCK_C_N: SI5324_CDR_DCXO_oscillators (C99.2 R84.1), DDMTD (C520.1), MCH_FPGA_Bank_47_48_67_HP_VHDCI (IC33.AC24)
REC_CLOCK_C_P: SI5324_CDR_DCXO_oscillators (C98.2 R84.2), DDMTD (C518.1), MCH_FPGA_Bank_47_48_67_HP_VHDCI (IC33.AB24)
REF_CLK1_N: Metlino_CLK_Distribution (C113.1), MCH_FPGA_Bank_47_48_67_HP_VHDCI (IC33.Y25 R86.2)
REF_CLK1_P: Metlino_CLK_Distribution (C10.1), MCH_FPGA_Bank_47_48_67_HP_VHDCI (IC33.W25 R49.2)
REF_CLK2_N: Metlino_CLK_Distribution (C183.1), MCH_FPGA_Banks_224_225_226_227_228 (IC33.T5)
REF_CLK2_P: Metlino_CLK_Distribution (C46.1), MCH_FPGA_Banks_224_225_226_227_228 (IC33.T6)
SCL1: SFP0 (R107B.2), I2C_MUX (IC43.4 IC44.4 R358.2)
SCL2: SFP1 (R107A.2), I2C_MUX (IC43.6 IC44.6 R356.2)
SCL3: I2C_MUX (IC43.8 IC44.8 R362.2), SFP2 (R107C.2)
SCL4: SI5324_CDR_DCXO_oscillators (IC18.22 TP9.1), I2C_MUX (IC43.11 IC44.11 R364.2)
SCL6: VHDCI_CON (D53.1 J14.17), I2C_MUX (IC43.15 IC44.15 R371.2)
SCL7: VHDCI_CON (D53.3 J15.17), I2C_MUX (IC43.17 IC44.17 R373.2)
SDA1: SFP0 (R106B.2), I2C_MUX (IC43.3 IC44.3 R357.2)
SDA2: SFP1 (R106A.2), I2C_MUX (IC43.5 IC44.5 R355.2)
SDA3: I2C_MUX (IC43.7 IC44.7 R361.2), SFP2 (R106C.2)
SDA4: SI5324_CDR_DCXO_oscillators (IC18.23 TP8.1), I2C_MUX (IC43.10 IC44.10 R363.2)
SDA6: VHDCI_CON (D53.6 J14.51), I2C_MUX (IC43.14 IC44.14 R370.2)
SDA7: VHDCI_CON (D53.4 J15.51), I2C_MUX (IC43.16 IC44.16 R372.2)
SDRAM64_CLK_N: SI5324_CDR_DCXO_oscillators (C564.2), MCH_FPGA_Banks_44_45_46_DDR64 (IC33.AK16 R11.2 R406.2)
SDRAM64_CLK_P: SI5324_CDR_DCXO_oscillators (C563.2), MCH_FPGA_Banks_44_45_46_DDR64 (IC33.AK17 R210.2 R406.1)
SFP0RX_N: SFP0 (J8B.12), MCH_FPGA_Banks_224_225_226_227_228 (IC33.D1)
SFP0RX_P: SFP0 (J8B.13), MCH_FPGA_Banks_224_225_226_227_228 (IC33.D2)
SFP0TX_N: SFP0 (J8B.19), MCH_FPGA_Banks_224_225_226_227_228 (IC33.D5)
SFP0TX_P: SFP0 (J8B.18), MCH_FPGA_Banks_224_225_226_227_228 (IC33.D6)
SFP1RX_N: SFP1 (J8A.12), MCH_FPGA_Banks_224_225_226_227_228 (IC33.B1)
SFP1RX_P: SFP1 (J8A.13), MCH_FPGA_Banks_224_225_226_227_228 (IC33.B2)
SFP1TX_N: SFP1 (J8A.19), MCH_FPGA_Banks_224_225_226_227_228 (IC33.C3)
SFP1TX_P: SFP1 (J8A.18), MCH_FPGA_Banks_224_225_226_227_228 (IC33.C4)
SFP2RX_N: SFP2 (J8C.12), MCH_FPGA_Banks_224_225_226_227_228 (IC33.E3)
SFP2RX_P: SFP2 (J8C.13), MCH_FPGA_Banks_224_225_226_227_228 (IC33.E4)
SFP2TX_N: SFP2 (J8C.19), MCH_FPGA_Banks_224_225_226_227_228 (IC33.F5)
SFP2TX_P: SFP2 (J8C.18), MCH_FPGA_Banks_224_225_226_227_228 (IC33.F6)
SMA_CLK_OUT: Metlino_MCH (J2.1), Metlino_CLK_Distribution (C328.1)

## Assembly variants
CMOS: not fitted C106 C118 C119 C120 C296 C297 C298 C299 C326 C532 C536 C557 IC1 IC14 J3 L8 MOD1 R42 R43 R44 R45 R46 R102C R103C R167 R169 R172 R173 R174 R181 R182 R183 R186 R275 R282 R293 R303 R305 R307 R308 R324 R330 R350 R352 R353 R392 R395 R424 R427 R430
LVDS: not fitted C106 C118 C119 C120 C296 C297 C298 C299 C326 C532 C536 C561 IC1 IC14 J3 L8 MOD1 R42 R43 R44 R45 R46 R102C R103C R167 R169 R172 R173 R174 R181 R182 R183 R186 R275 R282 R293 R303 R305 R306 R308 R324 R330 R350 R351 R352 R353 R392 R395 R424 R427 R430; alternate parts OSC3 -> OSC_0.2-800MHZ_SILICON-LAB_549BACB001937ABG, OSC4 -> OSC_0.2-800MHZ_SILICON-LAB_549BACB001937ABG, R278 -> R0402_0R_JUMPER, R349 -> R0402_0R_JUMPER